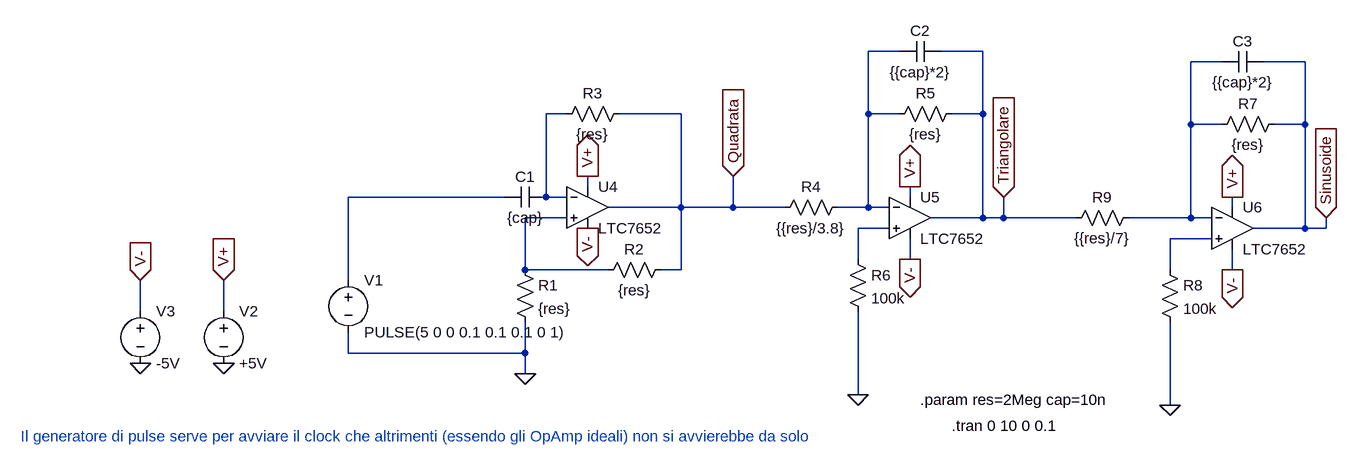
[diagram p0: schematic Progetto_PSE_reale_v1.asc]
Progetto_PSE_reale_v1.asc, the LTspice schematic file:
Version 4
SHEET 1 1336 680
WIRE 608 -176 560 -176
WIRE 736 -176 672 -176
WIRE 1104 -160 1056 -160
WIRE 1232 -160 1168 -160
WIRE 96 -80 64 -80
WIRE 272 -80 176 -80
WIRE 560 -80 560 -176
WIRE 608 -80 560 -80
WIRE 736 -80 736 -176
WIRE 736 -80 688 -80
WIRE 1056 -64 1056 -160
WIRE 1104 -64 1056 -64
WIRE 1232 -64 1232 -160
WIRE 1232 -64 1184 -64
WIRE 128 32 128 16
WIRE 0 48 -240 48
WIRE 64 48 64 -80
WIRE 96 48 64 48
WIRE 624 48 624 32
WIRE 272 64 272 -80
WIRE 272 64 160 64
WIRE 352 64 352 16
WIRE 352 64 272 64
WIRE 432 64 352 64
WIRE 560 64 560 -80
WIRE 560 64 512 64
WIRE 592 64 560 64
WIRE 1120 64 1120 48
WIRE 96 80 32 80
WIRE 736 80 736 -80
WIRE 736 80 656 80
WIRE 768 80 768 48
WIRE 768 80 736 80
WIRE 880 80 768 80
WIRE 1056 80 1056 -64
WIRE 1056 80 960 80
WIRE 1088 80 1056 80
WIRE 592 96 544 96
WIRE 1232 96 1232 -64
WIRE 1232 96 1152 96
WIRE 1264 96 1264 80
WIRE 1264 96 1232 96
WIRE 1088 112 1024 112
WIRE 544 144 544 96
WIRE 624 144 624 112
WIRE 32 160 32 80
WIRE 160 160 32 160
WIRE 272 160 272 64
WIRE 272 160 240 160
WIRE 1024 160 1024 112
WIRE 1120 160 1120 128
WIRE -240 176 -240 48
WIRE -560 224 -560 176
WIRE -432 224 -432 176
WIRE -240 288 -240 256
WIRE 32 288 32 240
WIRE 32 288 -240 288
WIRE 32 320 32 288
WIRE 544 352 544 224
WIRE 1024 368 1024 240
FLAG 32 320 0
FLAG 544 352 0
FLAG 624 32 V+
IOPIN 624 32 Out
FLAG 128 16 V+
IOPIN 128 16 Out
FLAG 128 96 V-
IOPIN 128 96 Out
FLAG 624 144 V-
IOPIN 624 144 Out
FLAG 768 48 Triangolare
IOPIN 768 48 In
FLAG 352 16 Quadrata
IOPIN 352 16 In
FLAG 1024 368 0
FLAG 1120 48 V+
IOPIN 1120 48 Out
FLAG 1120 160 V-
IOPIN 1120 160 Out
FLAG 1264 80 Sinusoide
IOPIN 1264 80 In
FLAG -432 304 0
FLAG -432 176 V+
IOPIN -432 176 In
FLAG -560 304 0
FLAG -560 176 V-
IOPIN -560 176 In
SYMBOL cap 64 32 R90
WINDOW 0 0 32 VBottom 2
WINDOW 3 32 32 VTop 2
SYMATTR InstName C1
SYMATTR Value {cap}
SYMBOL res 16 144 R0
SYMATTR InstName R1
SYMATTR Value {res}
SYMBOL res 256 144 R90
WINDOW 0 0 56 VBottom 2
WINDOW 3 32 56 VTop 2
SYMATTR InstName R2
SYMATTR Value {res}
SYMBOL res 192 -96 R90
WINDOW 0 0 56 VBottom 2
WINDOW 3 32 56 VTop 2
SYMATTR InstName R3
SYMATTR Value {res}
SYMBOL res 528 48 R90
WINDOW 0 0 56 VBottom 2
WINDOW 3 32 56 VTop 2
SYMATTR InstName R4
SYMATTR Value {{res}/3.8}
SYMBOL res 704 -96 R90
WINDOW 0 0 56 VBottom 2
WINDOW 3 32 56 VTop 2
SYMATTR InstName R5
SYMATTR Value {res}
SYMBOL cap 672 -192 R90
WINDOW 0 0 32 VBottom 2
WINDOW 3 32 32 VTop 2
SYMATTR InstName C2
SYMATTR Value {{cap}*2}
SYMBOL res 528 128 R0
SYMATTR InstName R6
SYMATTR Value 100k
SYMBOL res 1200 -80 R90
WINDOW 0 0 56 VBottom 2
WINDOW 3 32 56 VTop 2
SYMATTR InstName R7
SYMATTR Value {res}
SYMBOL cap 1168 -176 R90
WINDOW 0 0 32 VBottom 2
WINDOW 3 32 32 VTop 2
SYMATTR InstName C3
SYMATTR Value {{cap}*2}
SYMBOL res 1008 144 R0
SYMATTR InstName R8
SYMATTR Value 100k
SYMBOL res 976 64 R90
WINDOW 0 0 56 VBottom 2
WINDOW 3 32 56 VTop 2
SYMATTR InstName R9
SYMATTR Value {{res}/7}
SYMBOL voltage -240 160 R0
WINDOW 123 0 0 Left 0
WINDOW 39 0 0 Left 0
SYMATTR InstName V1
SYMATTR Value PULSE(5 0 0 0.1 0.1 0.1 0 1)
SYMBOL voltage -432 208 R0
WINDOW 123 0 0 Left 0
WINDOW 39 0 0 Left 0
SYMATTR InstName V2
SYMATTR Value +5V
SYMBOL voltage -560 208 R0
WINDOW 123 0 0 Left 0
WINDOW 39 0 0 Left 0
SYMATTR InstName V3
SYMATTR Value -5V
SYMBOL Opamps\\LTC7652 128 0 R0
SYMATTR InstName U4
SYMBOL Opamps\\LTC7652 624 16 R0
SYMATTR InstName U5
SYMBOL Opamps\\LTC7652 1120 32 R0
SYMATTR InstName U6
TEXT 688 400 Left 2 !.tran 0 10 0 0.1
TEXT 640 360 Left 2 !.param res=2Meg cap=10n
TEXT -744 416 Left 2 ;Il generatore di pulse serve per avviare il clock che altrimenti (essendo gli OpAmp ideali) non si avvierebbe da solo

The netlist it stands for:
* Progetto_PSE_reale_v1.asc
C1 N003 N004 {cap}
R1 N005 0 {res}
R2 Quadrata N005 {res}
R3 Quadrata N003 {res}
R4 N001 Quadrata {{res}/3.8}
R5 Triangolare N001 {res}
C2 Triangolare N001 {{cap}*2}
R6 N006 0 100k
R7 Sinusoide N002 {res}
C3 Sinusoide N002 {{cap}*2}
R8 N007 0 100k
R9 N002 Triangolare {{res}/7}
V1 N004 0 PULSE(5 0 0 0.1 0.1 0.1 0 1)
V2 V+ 0 +5V
V3 V- 0 -5V
XU4 N005 N003 V+ V- Quadrata LTC1052  ; LTC7652, pins In+ In- V+ V- OUT
XU5 N006 N001 V+ V- Triangolare LTC1052  ; LTC7652, pins In+ In- V+ V- OUT
XU6 N007 N002 V+ V- Sinusoide LTC1052  ; LTC7652, pins In+ In- V+ V- OUT
.tran 0 10 0 0.1
.param res=2Meg cap=10n
* Il generatore di pulse serve per avviare il clock che altrimenti (essendo gli OpAmp ideali) non si avvierebbe da solo
.backanno
.end